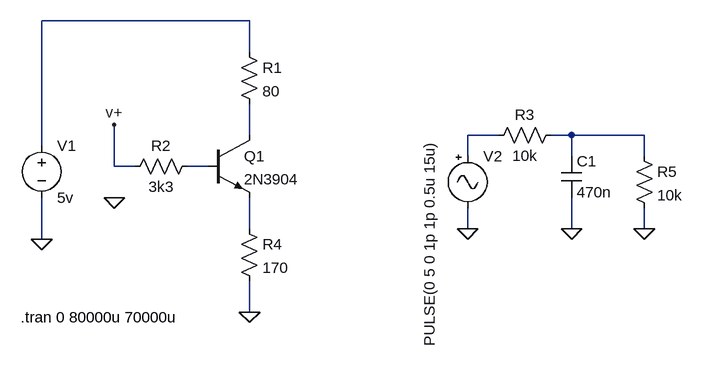
[diagram p0: schematic ldr.asc]
ldr.asc, the LTspice schematic file:
Version 4
SHEET 1 2160 680
WIRE 1088 -32 768 -32
WIRE 1088 16 1088 -32
WIRE 1088 144 1088 96
WIRE 1472 144 1424 144
WIRE 1584 144 1552 144
WIRE 1696 144 1584 144
WIRE 768 160 768 -32
WIRE 1424 176 1424 144
WIRE 1584 176 1584 144
WIRE 1696 176 1696 144
WIRE 880 192 880 128
WIRE 912 192 880 192
WIRE 1024 192 992 192
WIRE 1088 288 1088 240
WIRE 1424 288 1424 256
WIRE 1584 288 1584 240
WIRE 1696 288 1696 256
WIRE 768 304 768 240
WIRE 1088 416 1088 368
FLAG 768 304 0
FLAG 1088 416 0
FLAG 880 240 0
FLAG 880 128 v+
FLAG 1584 288 0
FLAG 1424 288 0
FLAG 1696 288 0
SYMBOL voltage 768 144 R0
WINDOW 123 0 0 Left 0
WINDOW 39 0 0 Left 0
SYMATTR InstName V1
SYMATTR Value 5v
SYMBOL npn 1024 144 R0
SYMATTR InstName Q1
SYMATTR Value 2N3904
SYMBOL res 1072 0 R0
SYMATTR InstName R1
SYMATTR Value 80
SYMBOL res 1072 272 R0
SYMATTR InstName R4
SYMATTR Value 170
SYMBOL res 1008 176 R90
WINDOW 0 0 56 VBottom 2
WINDOW 3 32 56 VTop 2
SYMATTR InstName R2
SYMATTR Value 3k3
SYMBOL res 1568 128 R90
WINDOW 0 0 56 VBottom 2
WINDOW 3 32 56 VTop 2
SYMATTR InstName R3
SYMATTR Value 10k
SYMBOL cap 1568 176 R0
SYMATTR InstName C1
SYMATTR Value 470n
SYMBOL Misc\\signal 1424 160 R0
WINDOW 3 -59 -8 VRight 2
WINDOW 123 0 0 Left 0
WINDOW 39 0 0 Left 0
SYMATTR InstName V2
SYMATTR Value PULSE(0 5 0 1p 1p 0.5u 15u)
SYMBOL res 1680 160 R0
SYMATTR InstName R5
SYMATTR Value 10k
TEXT 736 424 Left 2 !.tran 0 80000u 70000u

The netlist it stands for:
* ldr.asc
V1 N001 0 5v
Q1 N002 N005 N006 0 2N3904
R1 N001 N002 80
R4 N006 0 170
R2 N005 v+ 3k3
R3 N004 N003 10k
C1 N004 0 470n
V2 N003 0 PULSE(0 5 0 1p 1p 0.5u 15u)
R5 N004 0 10k
.model NPN NPN
.model PNP PNP
.lib standard.bjt
.tran 0 80000u 70000u
.backanno
.end